# EAGLE design SinclairScientificDisplay (EAGLE 9.2.0)
AUTHOR: w. boyett; CONTACT_COMPANY: Pacific Light & Hologram; LICENSE: CC-BY-SA; REV: 1A
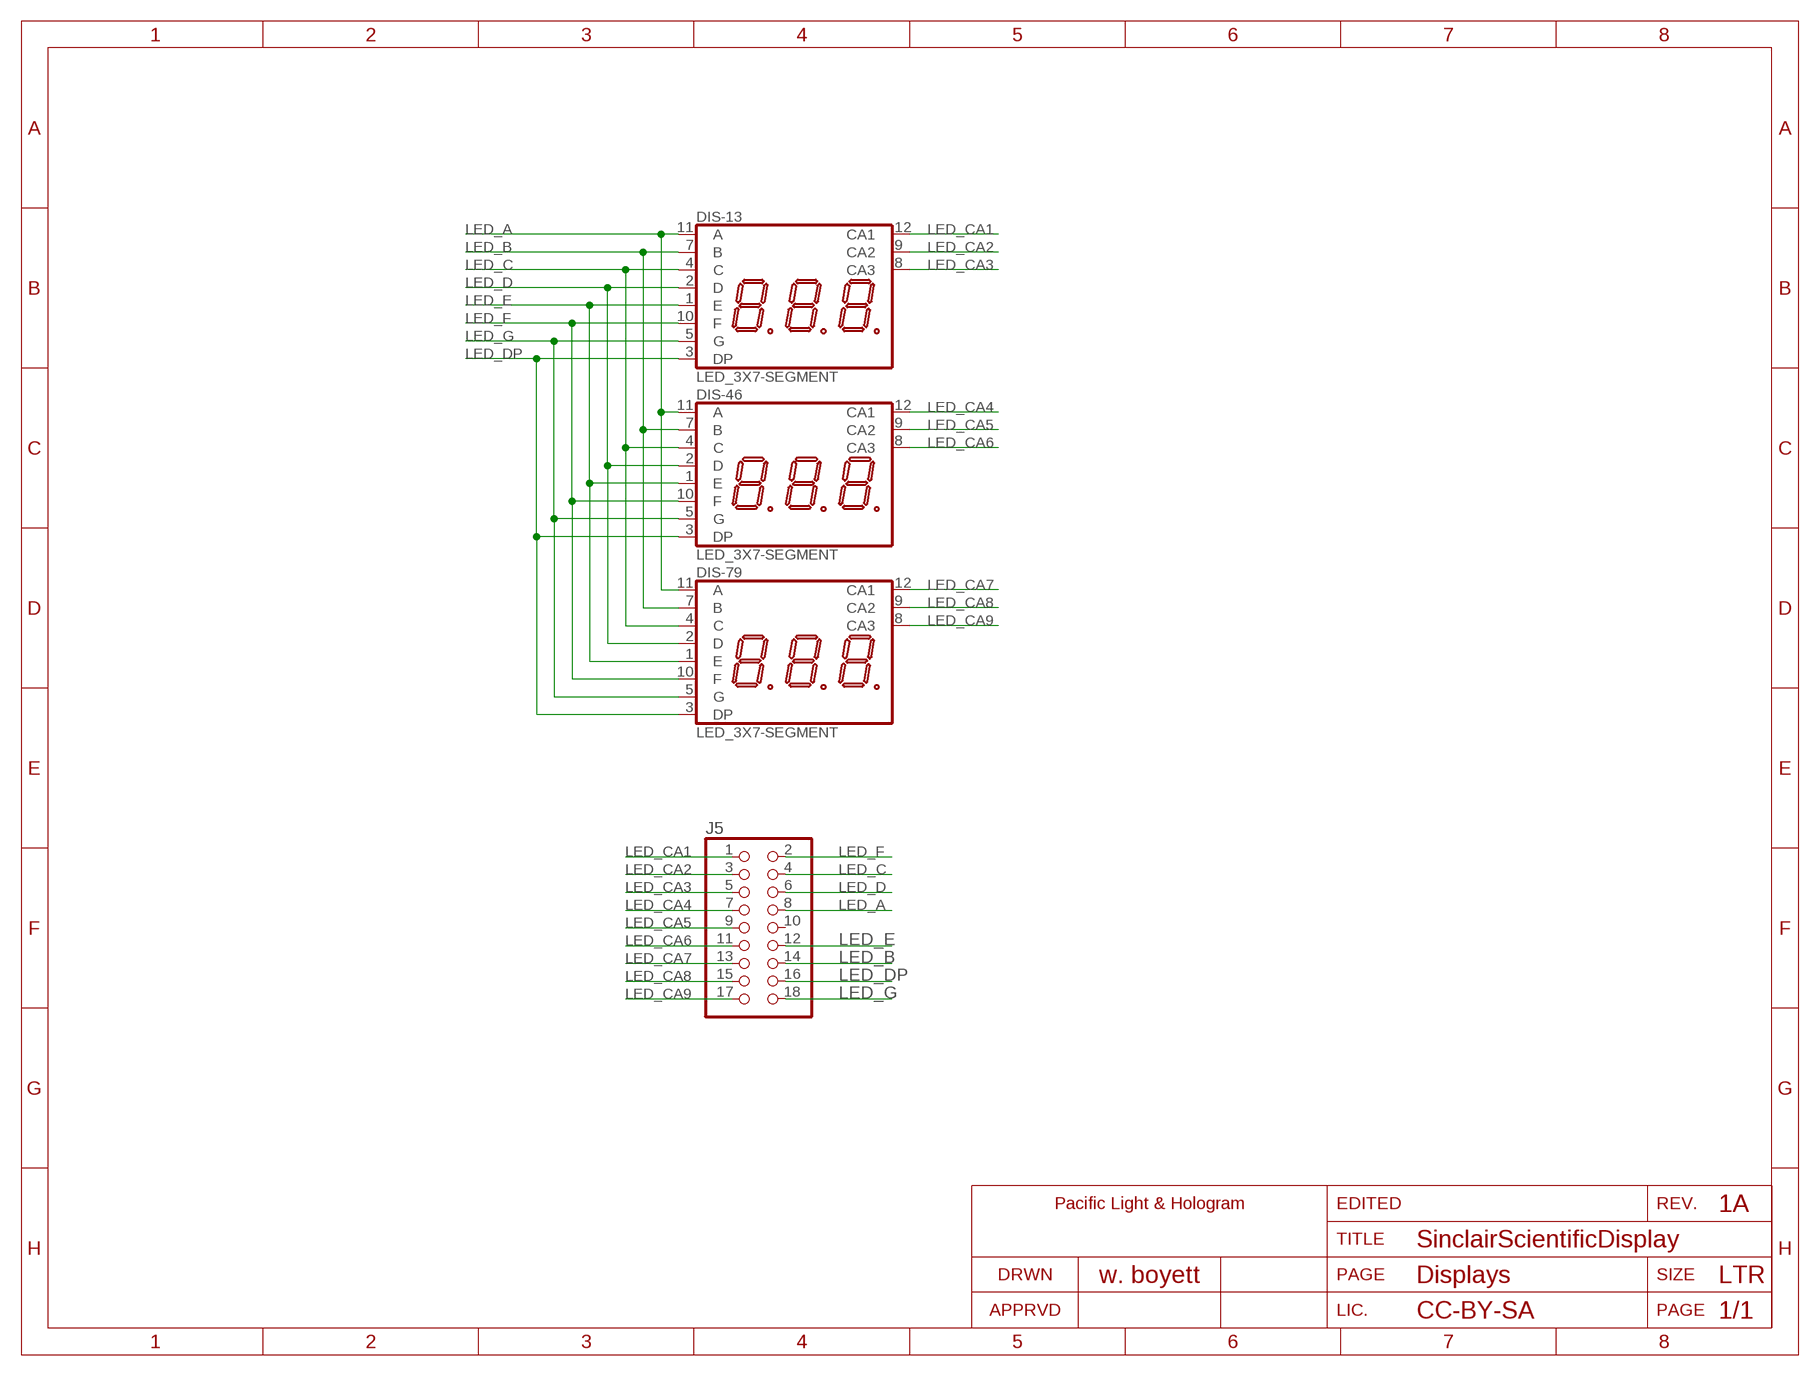
[diagram p0: schematic, sheet 1]
FRAME2 (LETTER_L): SECTION: Displays

## Parts
DIS-13  LED_3X7-SEGMENT  [2352B]
DIS-46  LED_3X7-SEGMENT  [2352B]
DIS-79  LED_3X7-SEGMENT  [2352B]
J5  PINHD-2X9-2MM  [2X09-2MM]

## Nets
LED_A: DIS-13.11(A) DIS-46.11(A) DIS-79.11(A) J5.8
LED_B: DIS-13.7(B) DIS-46.7(B) DIS-79.7(B) J5.14
LED_C: DIS-13.4(C) DIS-46.4(C) DIS-79.4(C) J5.4
LED_CA1: DIS-13.12(CA1) J5.1
LED_CA2: DIS-13.9(CA2) J5.3
LED_CA3: DIS-13.8(CA3) J5.5
LED_CA4: DIS-46.12(CA1) J5.7
LED_CA5: DIS-46.9(CA2) J5.9
LED_CA6: DIS-46.8(CA3) J5.11
LED_CA7: DIS-79.12(CA1) J5.13
LED_CA8: DIS-79.9(CA2) J5.15
LED_CA9: DIS-79.8(CA3) J5.17
LED_D: DIS-13.2(D) DIS-46.2(D) DIS-79.2(D) J5.6
LED_DP: DIS-13.3(DP) DIS-46.3(DP) DIS-79.3(DP) J5.16
LED_E: DIS-13.1(E) DIS-46.1(E) DIS-79.1(E) J5.12
LED_F: DIS-13.10(F) DIS-46.10(F) DIS-79.10(F) J5.2
LED_G: DIS-13.5(G) DIS-46.5(G) DIS-79.5(G) J5.18
Unconnected: J5.10

## Library data of the parts
DIS-13 = SinclairScientific:LED_3X7-SEGMENT: SINGLE DIGIT NUMERIC DISPLAY 9.9mm (0.39INCH) Source: SC39-11EWA.pdf; SPICEPREFIX: X
DIS-46 DIS-79 = SinclairScientific:LED_3X7-SEGMENT: SINGLE DIGIT NUMERIC DISPLAY 9.9mm (0.39INCH) Source: SC39-11EWA.pdf
J5 = SinclairScientific:PINHD-2X9: PIN HEADER; DNP: DNP; MFG: Molex

## Board
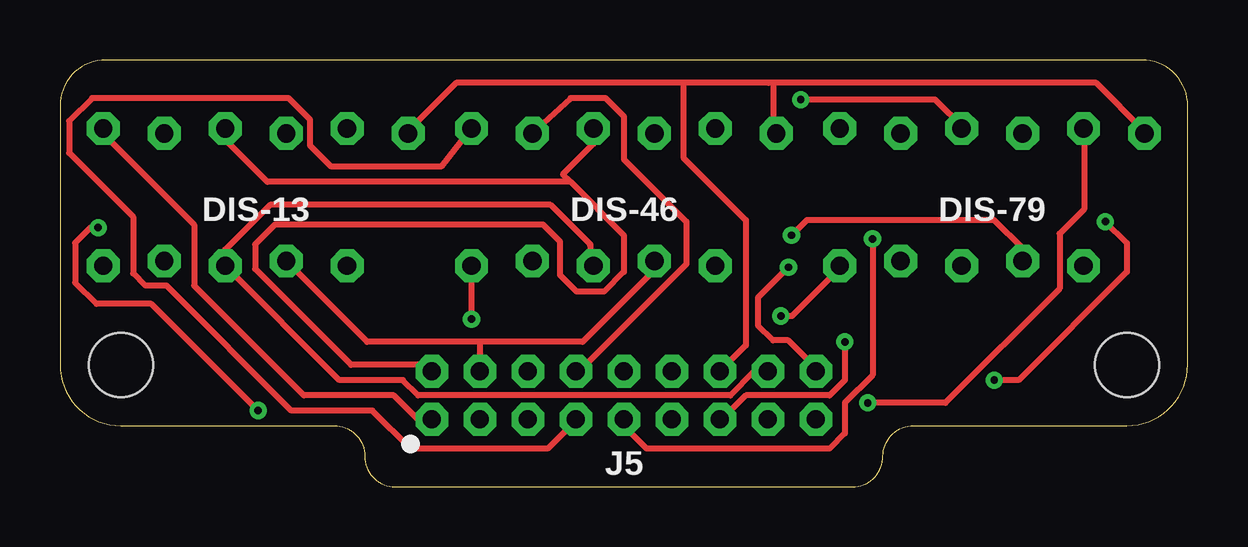
[diagram p1: board, top side]
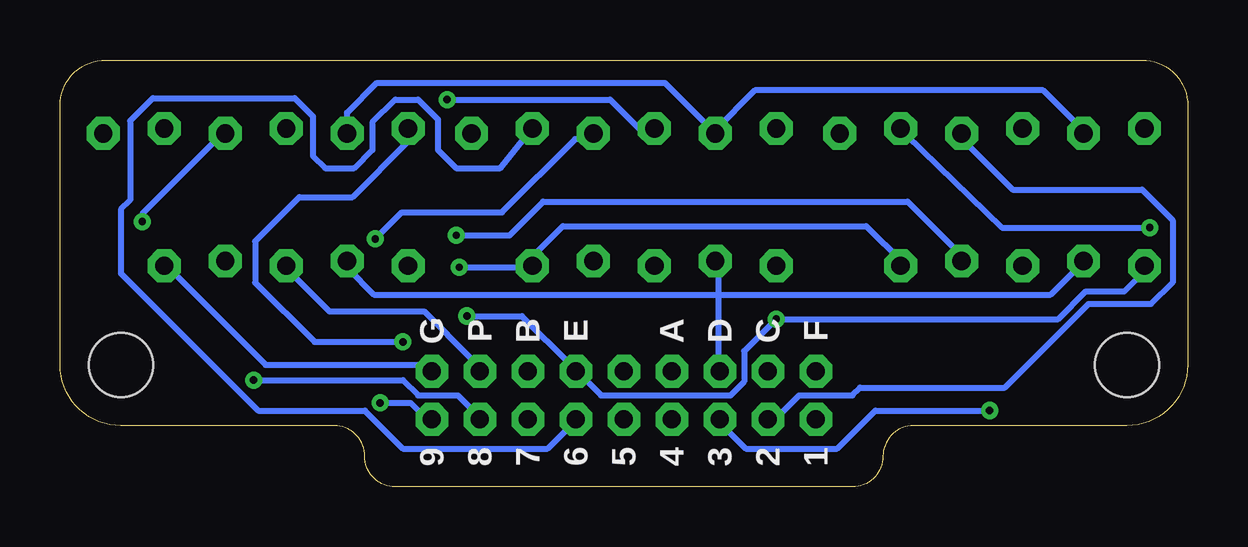
[diagram p2: board, bottom side, seen from below]

Size 46.99 x 17.78 mm. Coordinates in mm from the lower left corner, seen from the top.
Outline: 46.99,5.08 46.99,15.88 arc90 45.09,17.78 1.91,17.78 arc90 0,15.88 0,5.08 arc90 2.54,2.54 11.43,2.54 arc-90 12.7,1.27 arc90 13.97,0 33.02,0 arc90 34.29,1.27 arc-90 35.56,2.54 44.45,2.54 arc90 46.99,5.08
Copper layers (1*16): Top 0.035mm / dielectric 1.13mm / Bottom 0.035mm
Design rules "default": minimum track width 10mil, minimum drill 12mil, track to track 7mil, track to pad 7mil, pad to pad 7mil, via to via 7mil, smd to smd 7mil, copper to edge 10mil, drill to drill 10mil, minimum pad ring 12mil, minimum via ring 8mil, stop-mask expansion 2mil, vias tented up to drill 20mil, thermal gap 10mil

### Footprints (pad centres in the part's own frame; a part is rotated, then mirrored left to right if it is on the bottom)
2352B = drill 0.762 octagon: 1 -6.35,-2.862; 2 -3.81,-2.658; 3 -1.27,-2.862; 4 1.27,-2.658; 5 3.81,-2.862; 7 6.35,2.658; 8 3.81,2.862; 9 1.27,2.658; 10 -1.27,2.862; 11 -3.81,2.658; 12 -6.35,2.862
2X09-2MM = drill 0.75 octagon: 1 -8,-1; 2 -8,1; 3 -6,-1; 4 -6,1; 5 -4,-1; 6 -4,1; 7 -2,-1; 8 -2,1; 9 0,-1; 10 0,1; 11 2,-1; 12 2,1; 13 4,-1; 14 4,1; 15 6,-1; 16 6,1; 17 8,-1; 18 8,1
HOLE_3-48 = hole 2.667: 0,0

### Placement (x,y rotation side)
DIS-13  8.15,12.06 0 top
DIS-46  23.5,12.06 0 top
DIS-79  38.84,12.06 0 top
J5  23.5,3.81 0 top
U$1  [HOLE_3-48]  2.54,5.08 0 top
U$2  [HOLE_3-48]  44.45,5.08 0 top

### Tracks (layer width: path | path; a pad name or v marks a point on that pad's centre or on a via)
LED_A
  Top 0.254: J5.8 21.64,4.81 26.1,9.27 26.1,11.05 23.5,13.65 23.5,15.43 22.73,16.19 21.28,16.19 DIS-46.11
  Bottom 0.254: DIS-79.11 35.03,15.59 33.79,16.83 21.79,16.83 DIS-46.11 19.68,14.86 18.03,16.51 6.03,16.51 4.34,14.83 DIS-13.11
LED_B
  Top 0.254: 14.39,14.71 16.51,16.83 25.97,16.83 | 25.97,16.83 29.53,16.83 29.65,16.83 | 29.65,16.83 29.72,16.76 29.72,14.73 DIS-46.7 | 29.65,16.83 43.18,16.83 45.19,14.82 DIS-79.7 | J5.14 28.57,5.89 28.57,11.11 25.97,13.72 25.97,16.19 25.97,16.83 | 14.4,14.72 14.39,14.71 | DIS-13.7 14.41,14.72 14.39,14.71
LED_C  (via drill 0.3)
  Top 0.254: v30.48,10.48 31.11,11.11 38.92,11.11 40.11,9.93 DIS-79.4 | J5.4 17.5,6 17.46,6.03 | 17.46,6.03 21.78,6.03 24.89,9.14 DIS-46.4 | DIS-13.4 12.8,6.03 17.46,6.03
  Bottom 0.254: v30.48,10.48 28.26,10.48 26.86,11.88 11.67,11.88 9.42,9.63 DIS-13.4
LED_CA1
  Top 0.254: J5.1 14.91,2.81 13.91,3.81 10.16,3.81 5.59,8.38 5.59,10.92 1.7,14.81 1.8,14.91 DIS-13.12
LED_CA2
  Bottom 0.254: J5.3 17.46,2.54 16.19,3.81 13.97,3.81 13.65,4.13 7.62,4.13 4.13,7.62 1.52,7.62 0.64,8.51 0.64,11.11 1.91,12.38 7.3,12.38 9.27,14.35 9.27,14.67 9.32,14.72 DIS-13.9
LED_CA3  (via drill 0.3)
  Top 0.254: v1.59,10.8 1.27,10.8 0.64,10.16 0.64,8.51 1.52,7.62 3.81,7.62 v8.26,3.17
  Bottom 0.254: v1.59,10.8 7.75,10.8 11.75,14.67 11.75,14.81 11.86,14.93 DIS-13.8 | v8.26,3.17 13.02,3.17 14.61,1.59 18.41,1.59 19.37,2.54 J5.5
LED_CA4
  Top 0.254: DIS-46.12 15.88,13.33 11.3,13.33 10.41,14.22 10.41,15.3 9.53,16.19 1.33,16.19 0.38,15.24 0.38,13.91 3.05,11.24 3.05,8.89 3.56,8.38 4.44,8.38 9.64,3.17 13.02,3.17 14.61,1.59 20.32,1.59 21.27,2.54 J5.7
LED_CA5  (via drill 0.3)
  Top 0.254: v33.85,10.33 33.85,4.64 32.7,3.49 32.7,2.22 32.07,1.59 24.45,1.59 23.5,2.54 J5.9
  Bottom 0.254: DIS-46.9 25.53,14.48 28.57,11.43 32.75,11.43 v33.85,10.33
LED_CA6
  Bottom 0.254: DIS-46.8 28.64,13.27 30.48,13.27 31.24,14.03 31.24,15.3 32.07,16.13 33.02,16.13 33.97,15.18 33.97,14.03 34.73,13.27 35.94,13.27 36.45,13.78 36.45,15.43 37.21,16.19 43.12,16.19 44.07,15.24 44.07,11.94 44.45,11.56 44.45,8.89 38.73,3.17 34.29,3.17 32.7,1.59 26.67,1.59 25.72,2.54 J5.11
LED_CA7  (via drill 0.3)
  Top 0.254: v32.7,6.03 32.7,4.44 32.07,3.81 28.57,3.81 27.62,2.86 J5.13
  Bottom 0.254: v32.7,6.03 36.39,6.03 38.86,8.51 38.86,10.22 37.02,12.06 34.8,12.06 32.51,14.35 32.59,14.43 32.59,14.93 DIS-79.12
LED_CA8  (via drill 0.3)
  Top 0.254: v43.56,11.05 44.45,10.16 44.45,8.95 39.94,4.44 v38.92,4.44
  Bottom 0.254: v38.92,4.44 32.7,4.44 32.07,3.81 30.42,3.81 29.5,2.89 J5.15 | v43.56,11.05 43.56,11.37 40.21,14.72 DIS-79.9
LED_CA9  (via drill 0.3)
  Top 0.254: v33.66,3.49 36.89,3.49 41.66,8.25 41.66,10.54 42.67,11.56 42.67,14.8 42.65,14.83 DIS-79.8
  Bottom 0.254: v33.66,3.49 32.38,3.49 31.75,2.86 J5.17
LED_D
  Bottom 0.254: 19.56,8 5.71,8 4.34,9.37 DIS-13.2 | 19.56,8 33.91,8 34.99,9.08 35.03,9.12 DIS-79.2 | 19.56,8 19.56,8.25 19.56,9.28 DIS-46.2 | 19.56,8 19.56,7.87 19.56,4.9 J5.6
LED_DP
  Top 0.254: J5.16 29.21,4.76 28.89,4.76 27.94,3.81 14.92,3.81 14.29,4.44 11.64,4.44 DIS-13.3 6.88,9.88 8.75,11.75 20.45,11.75 22.1,10.1 DIS-46.3
  Bottom 0.254: J5.16 29.5,4.97 29.84,5.33 31.81,7.3 35.77,7.3 37.67,9.2 DIS-79.3
LED_E  (via drill 0.3)
  Top 0.254: DIS-46.1 v17.14,6.98 | v30.04,7.11 30.5,7.11 32.49,9.1 DIS-79.1
  Bottom 0.254: v30.04,7.11 27.75,7.11 25.72,5.08 J5.12 25.4,4.76 24.45,3.81 19.05,3.81 18.48,4.38 18.48,5.65 v17.14,6.98 5.4,6.98 4.24,8.14 2.65,8.14 1.61,9.18 1.64,9.2 DIS-13.1
LED_F  (via drill 0.3)
  Top 0.254: 21.27,12.7 8.64,12.7 6.78,14.55 6.78,14.93 DIS-13.10 | DIS-46.10 22.23,14.29 20.95,13.02 21.27,12.7 | 21.27,12.7 23.5,10.48 23.5,8.95 22.67,8.13 21.53,8.13 20.83,8.83 20.83,10.22 20.13,10.92 8.95,10.92 8.13,10.1 8.13,9.08 12.13,5.08 15.24,5.08 J5.2 | v30.86,16.13 36.47,16.13 37.67,14.93 DIS-79.10
  Bottom 0.254: v30.86,16.13 24.07,16.13 22.54,14.6 DIS-46.10
LED_G  (via drill 0.3)
  Top 0.254: v30.35,9.14 29.08,7.87 29.08,6.73 29.72,6.1 30.35,6.1 31.5,4.95 J5.18
  Bottom 0.254: J5.18 31.75,5.08 38.42,5.08 42.57,9.23 42.6,9.2 DIS-79.5 | v30.35,9.14 27.69,9.14 DIS-46.5 27.43,9.46 26.04,10.86 13.4,10.86 11.86,9.32 11.86,9.2 DIS-13.5

### Text on the board
bPlace: F | C | D | A | E | B | P | G | 1 | 2 | 3 | 4 | 5 | 6 | 7 | 8 | 9